# EAGLE schematic schematic (EAGLE 7.7.0)
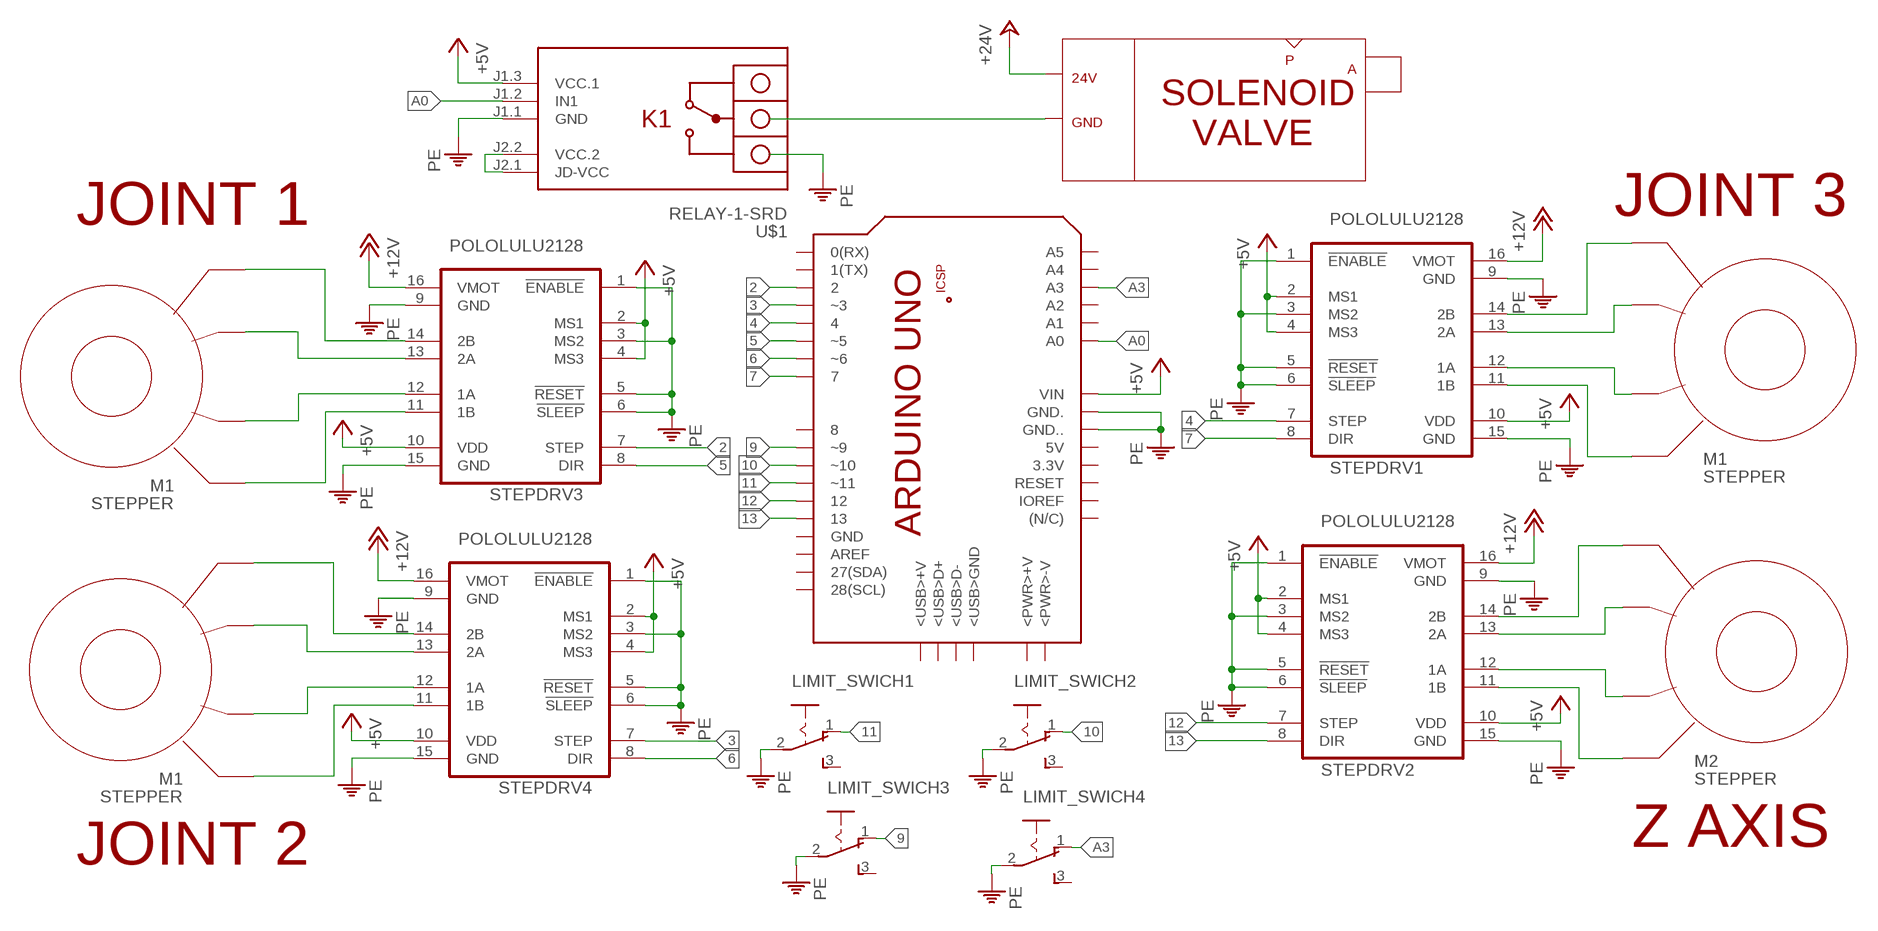
[diagram p0: schematic, sheet 1]

## Parts
LIMIT_SWICH1  255SB  [255SB]
LIMIT_SWICH2  255SB  [255SB]
LIMIT_SWICH3  255SB  [255SB]
LIMIT_SWICH4  255SB  [255SB]
PCB1  ARDUINO_UNO_EXT  (no package)
STEPDRV1  POLOLULU2128  [POLOLULU2128]
STEPDRV2  POLOLULU2128  [POLOLULU2128]
STEPDRV3  POLOLULU2128  [POLOLULU2128]
STEPDRV4  POLOLULU2128  [POLOLULU2128]
U$1  RELAY-1-SRD  [RELAY-1-SRD]

## Nets
2: PCB1.2 STEPDRV3.7(STEP)
3: PCB1.~3 STEPDRV4.7(STEP)
4: PCB1.4 STEPDRV1.7(STEP)
5: PCB1.~5 STEPDRV3.8(DIR)
6: PCB1.~6 STEPDRV4.8(DIR)
7: PCB1.7 STEPDRV1.8(DIR)
9: LIMIT_SWICH3.1(O) PCB1.~9
10: LIMIT_SWICH2.1(O) PCB1.~10
11: LIMIT_SWICH1.1(O) PCB1.~11
12: PCB1.12 STEPDRV2.7(STEP)
13: PCB1.13 STEPDRV2.8(DIR)
+5V: PCB1.VIN STEPDRV1.2(MS1) STEPDRV1.4(MS3) STEPDRV1.10(VDD) STEPDRV2.2(MS1) STEPDRV2.4(MS3) STEPDRV2.10(VDD) STEPDRV3.2(MS1) STEPDRV3.4(MS3) STEPDRV3.10(VDD) STEPDRV4.2(MS1) STEPDRV4.4(MS3) STEPDRV4.10(VDD) U$1.J1.3(VCC.1)
+12V: STEPDRV1.16(VMOT) STEPDRV2.16(VMOT) STEPDRV3.16(VMOT) STEPDRV4.16(VMOT)
A0: PCB1.A0 U$1.J1.2(IN1)
A3: LIMIT_SWICH4.1(O) PCB1.A3
N$1: STEPDRV1.14(2B)
N$2: STEPDRV1.11(1B)
N$3: STEPDRV1.13(2A)
N$4: STEPDRV1.12(1A)
N$5: STEPDRV2.14(2B)
N$6: STEPDRV2.11(1B)
N$7: STEPDRV2.13(2A)
N$8: STEPDRV2.12(1A)
N$9: STEPDRV3.14(2B)
N$10: STEPDRV3.11(1B)
N$11: STEPDRV3.13(2A)
N$12: STEPDRV3.12(1A)
N$13: STEPDRV4.14(2B)
N$14: STEPDRV4.11(1B)
N$15: STEPDRV4.13(2A)
N$16: STEPDRV4.12(1A)
N$17: U$1.J2.1(JD-VCC) U$1.J2.2(VCC.2)
PE: LIMIT_SWICH1.2(P) LIMIT_SWICH2.2(P) LIMIT_SWICH3.2(P) LIMIT_SWICH4.2(P) PCB1.GND. PCB1.GND.. STEPDRV1.1(!ENABLE) STEPDRV1.3(MS2) STEPDRV1.5(!RESET) STEPDRV1.6(!SLEEP) STEPDRV1.9(GND) STEPDRV1.15(GND) STEPDRV2.1(!ENABLE) STEPDRV2.3(MS2) STEPDRV2.5(!RESET) STEPDRV2.6(!SLEEP) STEPDRV2.9(GND) STEPDRV2.15(GND) STEPDRV3.1(!ENABLE) STEPDRV3.3(MS2) STEPDRV3.5(!RESET) STEPDRV3.6(!SLEEP) STEPDRV3.9(GND) STEPDRV3.15(GND) STEPDRV4.1(!ENABLE) STEPDRV4.3(MS2) STEPDRV4.5(!RESET) STEPDRV4.6(!SLEEP) STEPDRV4.9(GND) STEPDRV4.15(GND) U$1.J1.1(GND)
Unconnected: LIMIT_SWICH1.3(S) LIMIT_SWICH2.3(S) LIMIT_SWICH3.3(S) LIMIT_SWICH4.3(S) PCB1.0(RX) PCB1.1(TX) PCB1.3.3V PCB1.5V PCB1.8 PCB1.27(SDA) PCB1.28(SCL) PCB1.(N/C) PCB1.+5V PCB1.<PWR>+V PCB1.<PWR>-V PCB1.<USB>+V PCB1.<USB>D+ PCB1.<USB>D- PCB1.<USB>GND PCB1.A1 PCB1.A2 PCB1.A4 PCB1.A5 PCB1.AREF PCB1.GND PCB1.GND_ PCB1.IOREF PCB1.MISO PCB1.MOSI PCB1.RESET PCB1.RESET. PCB1.SCK

## Notes on the sheet
- P
- A
- 24V
- GND
- SOLENOID
     VALVE
- JOINT 1 | JOINT 3
- M1
- STEPPER
- M1
- STEPPER
- M2
- M1 | STEPPER
- STEPPER
- JOINT 2 | Z AXIS

## Library data of the parts
LIMIT_SWICH1-LIMIT_SWICH4 = switch:255SB: SLIDING SWITCH Distributor Buerklin, 11G810
PCB1 = arduino:ARDUINO_UNO_EXT: Device for representing an Arduino Uno board in an EAGLE design without the PCB footprint. Created by Dave Young for Element14. More EAGLE documentation at: http://www.element14.com/community/community/knode/cadsoft_eagle
STEPDRV1-STEPDRV4 = stepper_drivers_etc:POLOLULU2128
U$1 = diy-modules:RELAY-1-SRD: 1-Channel Relay Module based on SRD-05VDC-SL-C relays Click here to find device on ebay.com <http://www.ebay.com/sch/one+channel+isolated+relay+5v>